# EAGLE design herald_rev_c (EAGLE 8.6.0)

## Sheet 1 of 2
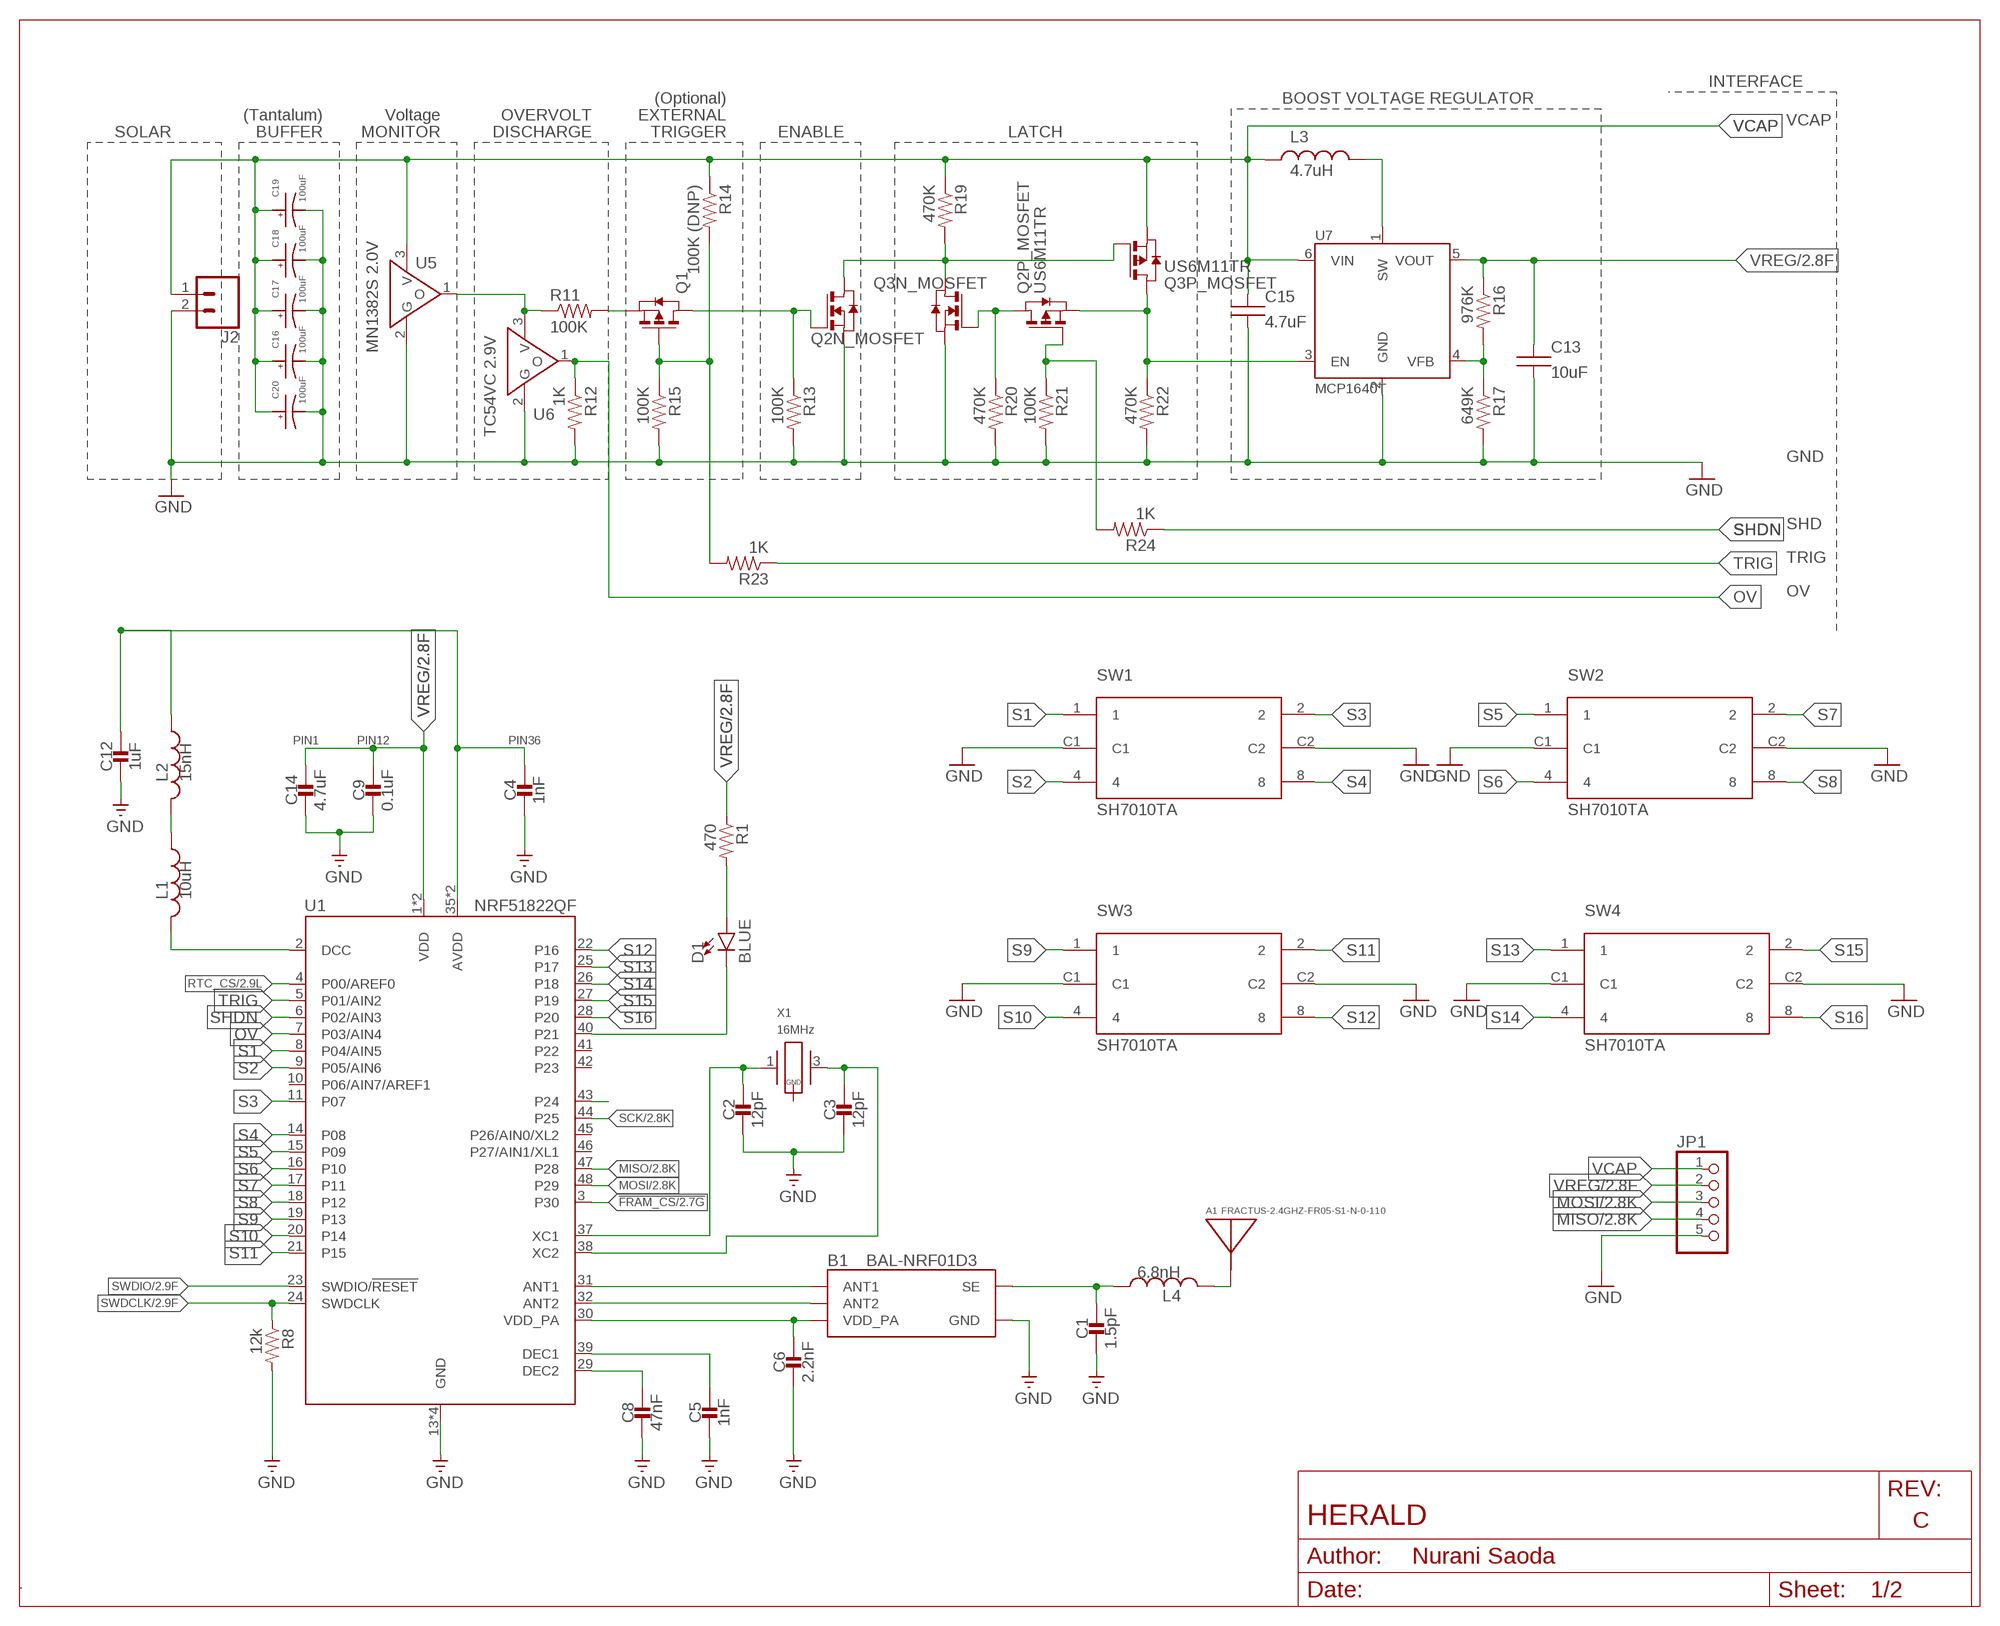
[diagram p0: schematic, sheet 1]
FRAME1 (LETTER_L_BLANK): AUTHOR: Nurani Saoda; REV: C; TITLE: HERALD

### Parts
A1  FRACTUS-2.4GHZ-FR05-S1-N-0-110  [FRACTUS-ANTENNA-FR05-S1-N-0-110]
B1  BAL-NRF01D3  [BAL-NRF01D3]
C1  1.5pF  CAPACITOR0402_CAP  [0402_CAP]
C2  12pF  CAPACITOR0402_CAP  [0402_CAP]
C3  12pF  CAPACITOR0402_CAP  [0402_CAP]
C4  1nF  CAPACITOR0402_CAP  [0402_CAP]
C5  1nF  CAPACITOR0402_CAP  [0402_CAP]
C6  2.2nF  CAPACITOR0402_CAP  [0402_CAP]
C8  47nF  CAPACITOR0402_CAP  [0402_CAP]
C9  0.1uF  CAPACITOR0402_CAP  [0402_CAP]
C12  1uF  CAPACITOR0402_CAP  [0402_CAP]
C13  10uF  CAP  [R0603B]
C14  4.7uF  CAPACITOR0402_CAP  [0402_CAP]
C15  4.7uF  CAP  [R0603B]
C16  100uF  1210_CAP_POLARIZED  [CAP1210]
C17  100uF  1210_CAP_POLARIZED  [CAP1210]
C18  100uF  1210_CAP_POLARIZED  [CAP1210]
C19  100uF  1210_CAP_POLARIZED  [CAP1210]
C20  100uF  1210_CAP_POLARIZED  [CAP1210]
D1  BLUE  LED-BLUE0603  [LED-0603]
J2  CONN_02  [1X02]
JP1  PINHD-1X5  [1X05]
L1  10uH  INDUCTOR0603  [0603_CAP]
L2  15nH  INDUCTOR0402  [0402_CAP]
L3  4.7uH  L-US  [L2828]
L4  6.8nH  INDUCTOR0402  [0402_CAP]
Q1  PMOSSOT23  [SOT-23]
Q2  US6M11TR  [TUMT6]
Q3  US6M11TR  [TUMT6]
R1  470  RESISTOR0402_RES  [0402_RES]
R8  12k  RESISTOR0402_RES  [0402_RES]
R11  100K  RESISTOR  [R0603B]
R12  1K  RESISTOR  [R0603B]
R13  100K  RESISTOR  [R0603B]
R14  100K (DNP)  RESISTOR  [R0603B]
R15  100K  RESISTOR  [R0603B]
R16  976K  RESISTOR  [R0603B]
R17  649K  RESISTOR  [R0603B]
R19  470K  RESISTOR  [R0603B]
R20  470K  RESISTOR  [R0603B]
R21  100K  RESISTOR  [R0603B]
R22  470K  RESISTOR  [R0603B]
R23  1K  RESISTOR  [R0603B]
R24  1K  RESISTOR  [R0603B]
SW1  SH7010TA  [SWTICH-6]
SW2  SH7010TA  [SWTICH-6]
SW3  SH7010TA  [SWTICH-6]
SW4  SH7010TA  [SWTICH-6]
U1  NRF51822QF  [QFN-48-6MM]
U5  MN1382S 2.0V  MN1382S  [MINI-3DC]
U6  TC54VC 2.9V  MN1382S  [MINI-3DC]
U7  MCP1640T  MCP1640  [SOT-23-6]
X1  16MHz  TXC-8Y  [TXC-8Y]

### Nets
!FRAM2_CS: U1.43(P24)
!FRAM_CS: U1.3(P30) ; also sheet 2
GND: B1.GND C1.2 C2.2 C3.2 C4.2 C5.2 C6.2 C8.2 C9.2 C12.2 C13.2 C14.2 C15.2 C16.ANODE C17.ANODE C18.ANODE C19.ANODE C20.ANODE J2.2 JP1.5 Q2.1(N_MOSFET:S) Q3.1(N_MOSFET:S) R8.2 R12.2 R13.2 R15.2 R17.2 R20.2 R21.2 R22.2 SW1.C1 SW1.C2 SW2.C1 SW2.C2 SW3.C1 SW3.C2 SW4.C1 SW4.C2 U1.13(GND) U1.33(GND) U1.34(GND) U1.GND U5.2(G) U6.2(G) U7.2(GND) ; also sheet 2
MISO: JP1.4 U1.47(P28) ; also sheet 2
MOSI: JP1.3 U1.48(P29) ; also sheet 2
N$1: A1.ANT(ANTENNA) L4.2
N$4: Q2.6(N_MOSFET:D) Q3.5(P_MOSFET:G) Q3.6(N_MOSFET:D) R19.2
N$5: B1.ANT1 U1.31(ANT1)
N$6: B1.ANT2 U1.32(ANT2)
N$7: D1.C U1.40(P21)
N$8: D1.A R1.2
N$10: Q2.4(P_MOSFET:S) Q3.3(P_MOSFET:D) R22.1 U7.3(EN)
N$11: B1.SE C1.1 L4.1
N$12: C4.1 C12.1 L2.1 U1.35(AVDD) U1.36(AVDD)
N$13: L1.2 U1.2(DCC)
N$14: L1.1 L2.2
N$16: C2.1 U1.37(XC1) X1.1
N$17: C3.1 U1.38(XC2) X1.3
N$18: C5.1 U1.39(DEC1)
N$19: C8.1 U1.29(DEC2)
N$20: R16.2 R17.1 U7.4(VFB)
N$21: L3.2 U7.1(SW)
N$24: Q2.3(P_MOSFET:D) Q3.2(N_MOSFET:G) R20.1
N$25: Q2.5(P_MOSFET:G) R21.1 R24.2
N$26: Q1.1(D) Q2.2(N_MOSFET:G) R13.1
N$28: R11.1 U5.1(O) U6.3(V)
N$29: Q1.3(G) R14.2 R15.1 R23.2
N$30: Q1.2(S) R11.2
OV: R12.1 U1.7(P03/AIN4) U6.1(O)
RTC_CS: U1.4(P00/AREF0) ; also sheet 2
S1: SW1.1 U1.8(P04/AIN5)
S2: SW1.4 U1.9(P05/AIN6)
S3: SW1.2 U1.11(P07)
S4: SW1.8 U1.14(P08)
S5: SW2.1 U1.15(P09)
S6: SW2.4 U1.16(P10)
S7: SW2.2 U1.17(P11)
S8: SW2.8 U1.18(P12)
S9: SW3.1 U1.19(P13)
S10: SW3.4 U1.20(P14)
S11: SW3.2 U1.21(P15)
S12: SW3.8 U1.22(P16)
S13: SW4.1 U1.25(P17)
S14: SW4.4 U1.26(P18)
S15: SW4.2 U1.27(P19)
S16: SW4.8 U1.28(P20)
SCK: U1.44(P25) ; also sheet 2
SHDN: R24.1 U1.6(P02/AIN3)
SWDCLK: R8.1 U1.24(SWDCLK) ; also sheet 2
SWDIO: U1.23(SWDIO/!RESET) ; also sheet 2
TRIG: R23.1 U1.5(P01/AIN2)
VCAP: C15.1 C16.CATHODE C17.CATHODE C18.CATHODE C19.CATHODE C20.CATHODE J2.1 JP1.1 L3.1 Q3.4(P_MOSFET:S) R14.1 R19.1 U5.3(V) U7.6(VIN)
VDD_PA: B1.VCC(VDD_PA) C6.1 U1.30(VDD_PA)
VREG: C9.1 C13.1 C14.1 JP1.2 R1.1 R16.1 U1.1(VDD) U1.12(VDD) U7.5(VOUT) ; also sheet 2
Unconnected: U1.10(P06/AIN7/AREF1) U1.41(P22) U1.42(P23) U1.45(P26/AIN0/XL2) U1.46(P27/AIN1/XL1) X1.2(GND) X1.4(GND)

### Notes on the sheet
- INTERFACE
- (Optional) | BOOST VOLTAGE REGULATOR
- (Tantalum) | Voltage | OVERVOLT | EXTERNAL
- SOLAR | BUFFER | MONITOR | DISCHARGE | TRIGGER | ENABLE | LATCH | VCAP
- GND
- SHD
- TRIG
- OV
- PIN1 | PIN12 | PIN36

## Sheet 2 of 2
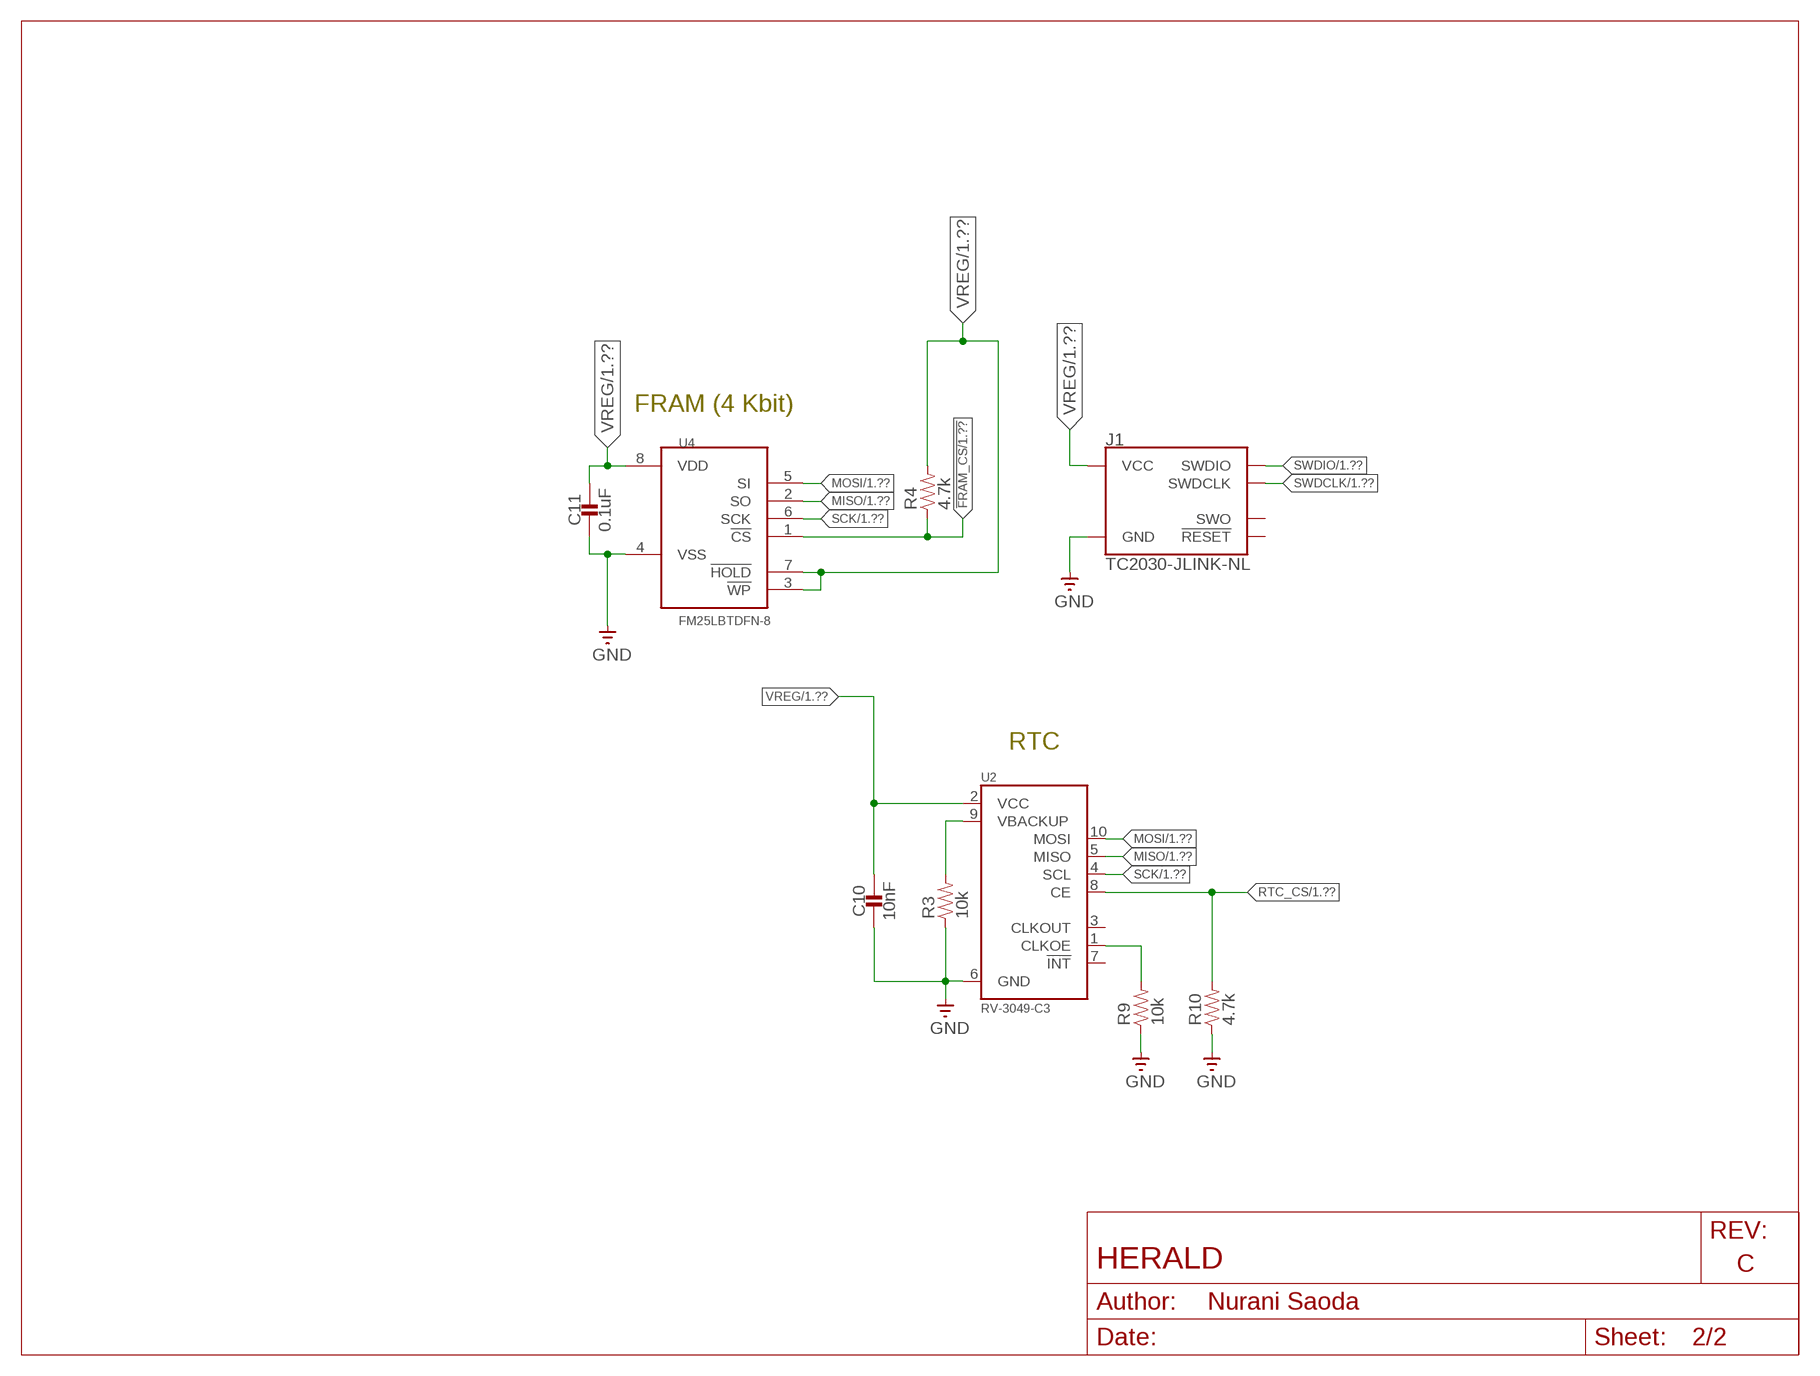
[diagram p1: schematic, sheet 2]
FRAME2 (LETTER_L_BLANK): AUTHOR: Nurani Saoda; REV: C; TITLE: HERALD

### Parts
C10  10nF  CAPACITOR0402_CAP  [0402_CAP]
C11  0.1uF  CAPACITOR0402_CAP  [0402_CAP]
J1  TC2030-JLINK-NL  [TC2030-IDC-NL]
R3  10k  RESISTOR0402_RES  [0402_RES]
R4  4.7k  RESISTOR0402_RES  [0402_RES]
R9  10k  RESISTOR0402_RES  [0402_RES]
R10  4.7k  RESISTOR0402_RES  [0402_RES]
U2  RV-3049-C3  [MICRO-CRYSTAL-C3]
U4  FM25LBTDFN-8  [TDFN-8@1]

### Nets
!FRAM_CS: R4.1 U4.1(!CS) ; also sheet 1
GND: C10.2 C11.2 J1.5(GND) R3.1 R9.1 R10.1 U2.6(GND) U4.4(VSS) ; also sheet 1
MISO: U2.5(MISO) U4.2(SO) ; also sheet 1
MOSI: U2.10(MOSI) U4.5(SI) ; also sheet 1
N$2: R3.2 U2.9(VBACKUP)
N$3: R9.2 U2.1(CLKOE)
RTC_CS: R10.2 U2.8(CE) ; also sheet 1
SCK: U2.4(SCL) U4.6(SCK) ; also sheet 1
SWDCLK: J1.4(SWDCLK) ; also sheet 1
SWDIO: J1.2(SWDIO) ; also sheet 1
VREG: C10.1 C11.1 J1.1(VCC) R4.2 U2.2(VCC) U4.3(!WP) U4.7(!HOLD) U4.8(VDD) ; also sheet 1
Unconnected: J1.3(!RESET) J1.6(SWO) U2.3(CLKOUT) U2.7(!INT)

### Notes on the sheet
- FRAM (4 Kbit)
- RTC

## Library data of the parts
A1 = chips:FRACTUS-2.4GHZ-FR05-S1-N-0-110: Fractus Micro Reach Xtend Requires matching network.; RICHARDSON_RFPD: FR05-S1-N-0110B
B1 = chips:BAL-NRF01D3: 50 ohm nominal input / conjugate match balun to nRF51422-QFAA, nRF24LE1, nRF51822-QFAA/AB, with integrated harmonic filter; DIGIKEY: 497-13637-1-ND; MANUFACTURER: STMicroelectronics; MOUSER: 511-BAL-NRF01D3; MPN: BAL-NRF01D3
C1-C6 C8-C12 C14 = passives:CAPACITOR: SMD Capacitor
C13 C15 = Gecko:CAP
C16-C20 = Gecko:1210_CAP_POLARIZED
D1 = SparkFun-LED:LED-BLUE: Blue SMD LED Used in manufacturing of various products at SparkFun Packages: 0603 - SMD 0603 package [Product Link] <http://www.digikey.com/product-detail/en/SMLE12BC7TT86/511-1589-2-ND/1641808> 1206 - SMD1206 package [Product Link] <http://www.digikey.com/product-detail/en/lite-on-inc/LTST-C150TBKT/160-1643-1-ND/573584> SparkFun Products: ESP8266 Thing-Dev Board <https://www.sparkfun.com/products/13711> RedBoard <https://www.sparkfun.com/products/12757>; PROD_ID: DIO-08575
J1 = connector:TC2030-JLINK
J2 = SparkFun-Retired:CONN_02: Multi connection point. Often used as Generic Header-pin footprint for 0.1 inch spaced/style header connections On any of the 0.1 inch spaced packages, you can populate with these: Break Away Headers - Straight <https://www.sparkfun.com/products/116> (PRT-00116) Break Away Male Headers - Right Angle <https://www.sparkfun.com/products/553> (PRT-00553) Female Headers <https://www.sparkfun.com/products/115> (PRT-00115) Break Away Headers - Machine Pin <https://www.sparkfun.com/products/117> (PRT-00117) Break Away Female Headers - Swiss Machine Pin <https://www.sparkfun.com/products/743> (PRT-00743) For SCREWTERMINALS and SPRING TERMINALS visit here: Screw Terimnals on SparkFun.com <https://www.sparkfun.com/search/results?term=Screw+Terminals> (5mm/3.5mm/2.54mm spacing) This device is also useful as a general connection point to wire up your design to another part of your project. Our various solder wires solder well into these plated through hole pads. Hook-Up Wire - Assortment (Stranded, 22 AWG) <https://www.sparkfun.com/products/11375> (PRT-11375) Hook-Up Wire - Assortment (Solid Core, 22 AWG) <https://www.sparkfun.com/products/11367> (PRT-11367) View the entire wire category on our website here <https://www.sparkfun.com/categories/141> Special notes: Molex polarized connector foot print use with: PRT-08233 with associated crimp pins and housings. 2.54_SCREWTERM for use with PRT-10571. 3.5mm Screw Terminal footprints for PRT-08084 5mm Screw Terminal footprints for use with PRT-08432
JP1 = pinhead:PINHD-1X5: PIN HEADER
L1 = passives:INDUCTOR: A very specific inductor; DIGIKEY: 490-4025-1-ND
L2 L4 = passives:INDUCTOR: A very specific inductor; DIGIKEY: 587-1521-1-ND
L3 = Gecko:L-US
Q1 = berkeley-epic:PMOSSOT23: MOS FET
Q2 Q3 = DUALMOS:US6M11TR; DIGIKEY: US6M11CT-ND
R1 = passives:RESISTOR: Resistor Basic schematic elements and footprints for 0603, 1206, and PTH resistors.; DIGIKEY: RHM470CECT-ND
R3 R9 = passives:RESISTOR: Resistor Basic schematic elements and footprints for 0603, 1206, and PTH resistors.; DIGIKEY: RHM10KCECT-ND
R4 R10 = passives:RESISTOR: Resistor Basic schematic elements and footprints for 0603, 1206, and PTH resistors.; DIGIKEY: RHM4.7KCECT-ND
R8 = passives:RESISTOR: Resistor Basic schematic elements and footprints for 0603, 1206, and PTH resistors.; DIGIKEY: RHM12.0KCDCT-ND
R11-R17 R19-R24 = Gecko:RESISTOR
SW1-SW4 = sh7010TA:SH7010TA; DIGIKEY: 563-1207-2-ND
U1 = chips:NRF51822: Multiprotocol Bluetooth® 4.0 low energy/2.4 GHz RF SoC; DIGIKEY: 1490-1042-1-ND; MANUFACTURER: Nordic Semi; MOUSER: 949-NRF51822-QFAC-R7; MPN: NRF51822-QFAC-R7
U2 = chips:RV-3049-C3: The RV-3049-C3 is an ultra miniature Real-Time-Clock Module with embedded Crystal. This RTC has an SPI Bus (4-wire Serial- Interface) and offers temperature compensated time.; NEWARK: RV-3049-C3
U4 = chips:FM25LB: IC FRAM 4KBIT 10MHZ 8SOIC; DIGIKEY: FM25L04B-DGRA-ND; MOUSER: 877-FM25L04B-DG
U5 U6 = umich:MN1382S
U7 = Gecko:MCP1640
X1 = crystals:TXC-8Y: 2mmx1.6mm SMD Crystal; DIGIKEY: 887-2003-1-ND

## Board
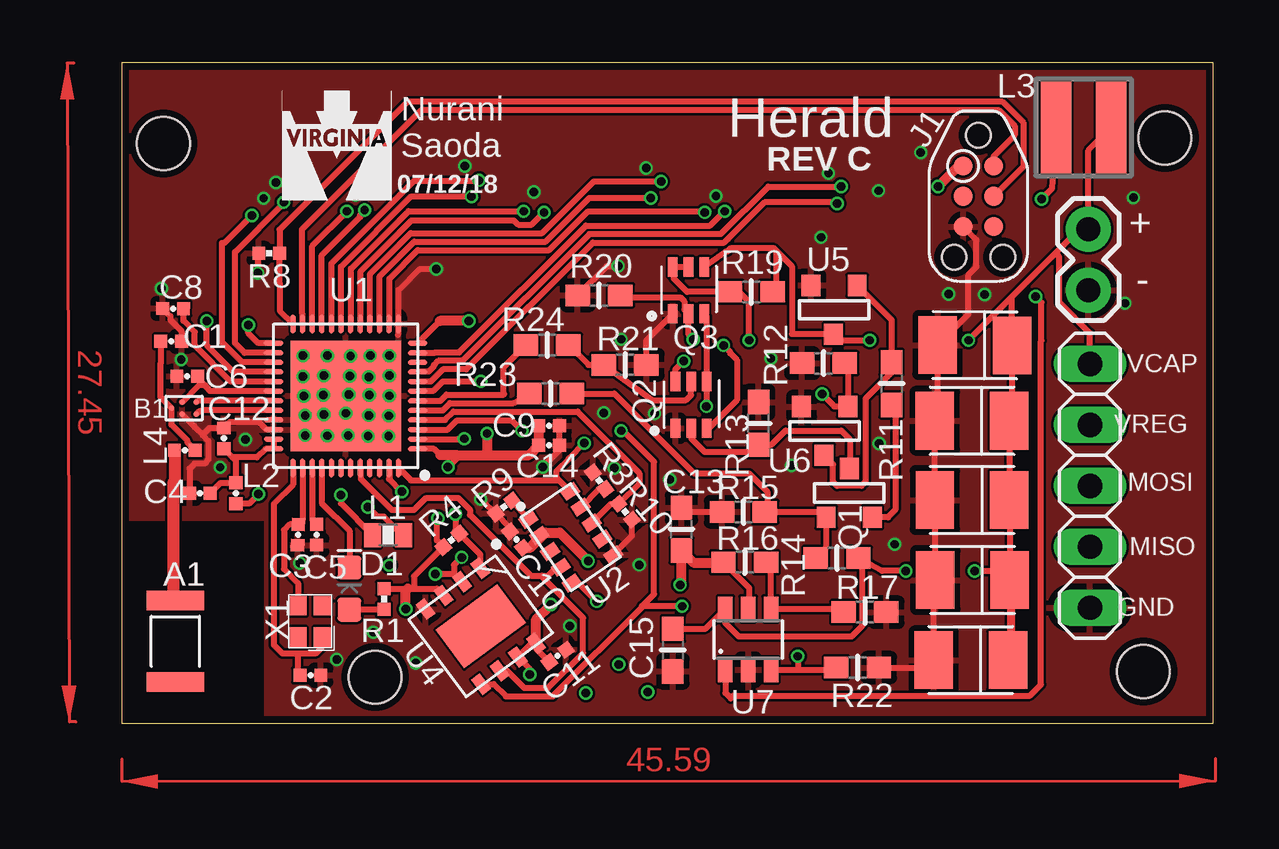
[diagram p2: board, top side]
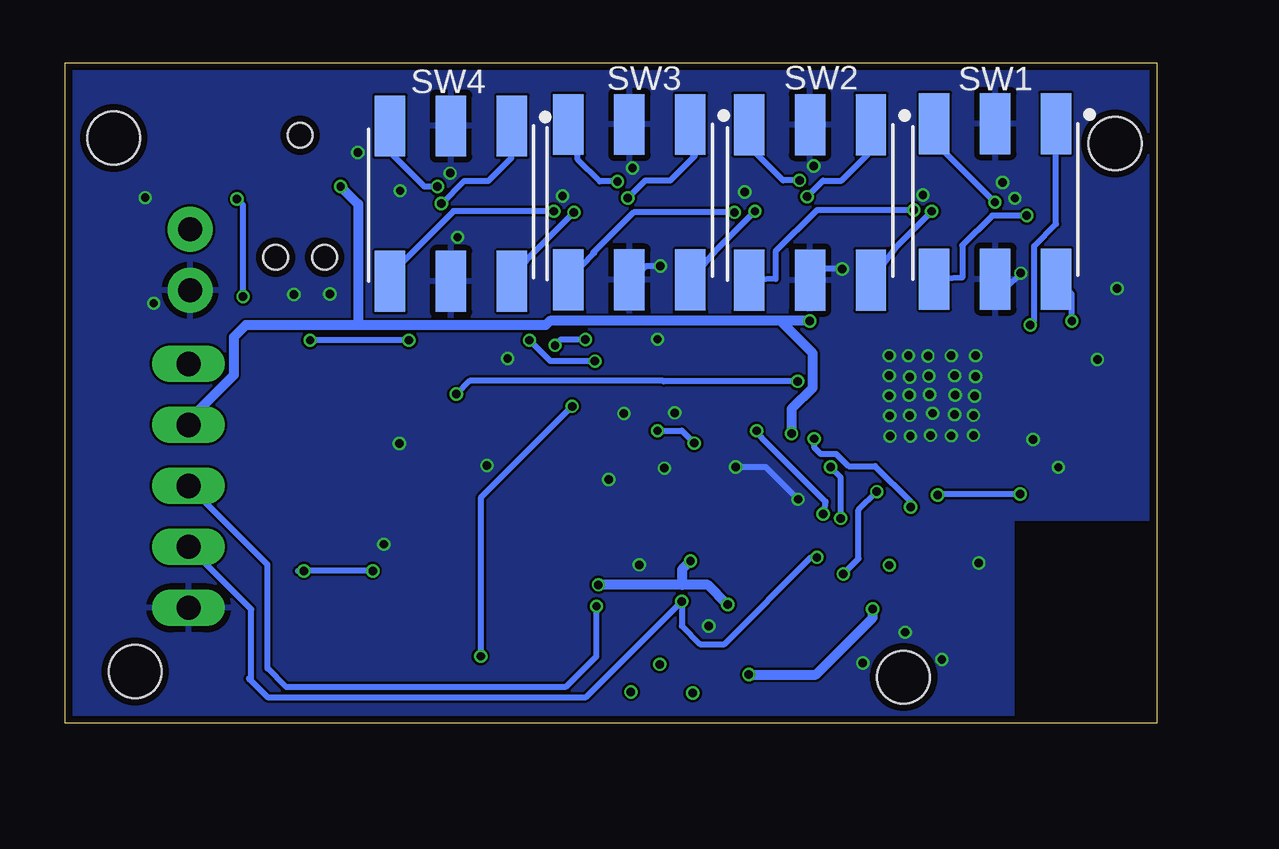
[diagram p3: board, bottom side, seen from below]

Size 45.5 x 27.53 mm. Coordinates in mm from the lower left corner, seen from the top.
Outline: 0,27.53 0,0 45.5,0 45.5,27.53 0,27.53
Copper layers (1*16): Top 0.0178mm / dielectric 59mil / Bottom 0.0178mm
Design rules "quickturn_co_kr_1oz *": minimum track width 4mil, minimum drill 0.200659375mm, track to track 4mil, track to pad 6mil, pad to pad 6mil, via to via 6mil, smd to smd 6mil, copper to edge 12mil, drill to drill 12mil, minimum pad ring 8mil, minimum via ring 4mil, stop-mask expansion 3mil, vias tented up to drill 50mil, thermal gap 10mil
Holes 2.2 mm at 10.56,1.92 43.48,24.39 42.58,2.16 1.73,24.16

### Footprints (pad centres in the part's own frame; a part is rotated, then mirrored left to right if it is on the bottom)
FRACTUS-ANTENNA-FR05-S1-N-0-110 = smd 0.8 x 2.4: ANT -1.7,0; NULL 1.7,0
BAL-NRF01D3 = smd 0.22 x 0.22: ANT1 -0.517,-0.25; ANT2 -0.517,0.25; GND 0.083,0.25; SE 0.516,0; VCC 0.083,-0.25
0402_CAP = smd 0.536 x 0.546: 1 -0.433,0; 2 0.433,0
R0603B = smd 1.016 x 0.889: 1 -0.889,0; 2 0.889,0
CAP1210 = smd 2.4 x 1.6: ANODE 0,-1.55; CATHODE 0,1.55
LED-0603 = smd 1 x 1: A -0.877,0; C 0.877,0
TC2030-IDC-NL = smd 0.787 x 0.787: 1 -1.27,-0.635; 2 -1.27,0.635; 3 0,-0.635; 4 0,0.635; 5 1.27,-0.635; 6 1.27,0.635 | hole 1.016: -2.54,0; 2.54,1.016; 2.54,-1.016
1X02 = drill 1.016 pad 1.88: 1 0,0; 2 2.54,0
1X05 = drill 1.016 long: 1 -5.08,0; 2 -2.54,0; 3 0,0; 4 2.54,0; 5 5.08,0
0603_CAP = smd 0.7 x 1: 1 -0.65,0; 2 0.65,0
L2828 = smd 1.27 x 3.81: 1 -1.143,0; 2 1.143,0
SOT-23 = smd 0.787 x 0.889: 1 0.025,-1.016; 2 -0.94,1.016; 3 0.991,1.016
TUMT6 = smd 0.4 x 0.8: 1 -0.65,-0.65; 2 0,-0.65; 3 0.65,-0.65; 4 0.65,1.3; 5 0,1.3; 6 -0.65,1.3
0402_RES = smd 0.536 x 0.546: 1 -0.433,0; 2 0.433,0
SWTICH-6 = smd 2.54 x 1.27: 1 0,2.54; 2 6.477,-2.54; 4 0,-2.54; 8 6.477,2.54; C1 0,0; C2 6.477,0
QFN-48-6MM = smd 0.8 x 0.203: 1 -3,2.2; 2 -3,1.8; 3 -3,1.4; 4 -3,1; 5 -3,0.6; 6 -3,0.2; 7 -3,-0.2; 8 -3,-0.6; 9 -3,-1; 10 -3,-1.4; 11 -3,-1.8; 12 -3,-2.2; 25 3,-2.2; 26 3,-1.8; 27 3,-1.4; 28 3,-1; 29 3,-0.6; 30 3,-0.2; 31 3,0.2; 32 3,0.6; 33 3,1; 34 3,1.4; 35 3,1.8; 36 3,2.2 | smd 0.203 x 0.8: 13 -2.2,-3; 14 -1.8,-3; 15 -1.4,-3; 16 -1,-3; 17 -0.6,-3; 18 -0.2,-3; 19 0.2,-3; 20 0.6,-3; 21 1,-3; 22 1.4,-3; 23 1.8,-3; 24 2.2,-3; 37 2.2,3; 38 1.8,3; 39 1.4,3; 40 1,3; 41 0.6,3; 42 0.2,3; 43 -0.2,3; 44 -0.6,3; 45 -1,3; 46 -1.4,3; 47 -1.8,3; 48 -2.2,3 | smd 4.6 x 4.6: GND 0,0
MICRO-CRYSTAL-C3 = smd 0.5 x 0.7: 1 -1.6,-1.05; 2 -0.8,-1.05; 3 0,-1.05; 4 0.8,-1.05; 5 1.6,-1.05; 6 1.6,1.05; 7 0.8,1.05; 8 0,1.05; 9 -0.8,1.05; 10 -1.6,1.05
TDFN-8@1 = smd 0.45 x 0.8: 1 -1.425,-1.95; 2 -0.475,-1.95; 3 0.475,-1.95; 4 1.425,-1.95; 5 1.425,1.95; 6 0.475,1.95; 7 -0.475,1.95; 8 -1.425,1.95 | smd 3.2 x 2: NC 0,0
MINI-3DC = smd 0.787 x 0.889: 1 -0.991,-1.016; 2 0.94,-1.016; 3 0,1.016
SOT-23-6 = smd 0.61 x 1.016: 1 -0.953,-1.27; 2 0,-1.27; 3 0.953,-1.27; 4 0.953,1.27; 5 0,1.27; 6 -0.953,1.27
TXC-8Y = smd 0.8 x 0.7: 1 -0.65,-0.5; 2 0.65,-0.5; 3 0.65,0.5; 4 -0.65,0.5

### Placement (x,y rotation side)
A1  2.23,3.42 270 top
B1  2.59,13.13 180 top
C1  2.06,15.91 0 top
C2  7.86,2 0 top
C3  7.35,7.85 267.7 top
C4  3.26,9.59 180 top
C5  8.12,7.86 270 top
C6  2.73,14.45 180 top
C8  2.14,17.28 179.4 top
C9  17.81,12.4 0 top
C10  16.45,7.66 128.7 top
C11  18.17,2.81 36.6 top
C12  4.25,11.87 90 top
C13  23.33,8.09 90 top
C14  17.81,11.58 0 top
C15  22.97,3.05 270 top
C16  35.56,15.75 269.8 top
C17  35.44,12.61 270 top
C18  35.44,9.3 270 top
C19  35.46,5.97 270 top
C20  35.39,2.63 270 top
D1  9.49,5.61 90 top
J1  35.71,21.96 270 top
J2  40.29,20.58 270 top
JP1  40.35,9.89 270 top
L1  11.1,7.85 0 top
L2  4.76,9.59 270 top
L3  40.09,24.82 180 top
L4  2.63,11.38 180 top
Q1  30.35,9.6 180 top
Q2  23.73,12.94 0 top
Q3  23.62,17.71 0 top
R1  10.93,5.18 270 top
R3  19.89,10.11 306.8 top
R4  13.74,7.63 220.2 top
R8  6.14,19.58 180 top
R9  15.93,9.01 38.3 top
R10  20.99,8.81 130.2 top
R11  32.08,14.16 270 top
R12  29.25,15.01 180 top
R13  26.54,12.5 90 top
R14  29.81,6.89 180 top
R15  25.91,8.81 180 top
R16  25.97,6.71 0 top
R17  30.98,4.63 0 top
R19  26.24,17.98 180 top
R20  19.89,17.83 180 top
R21  20.98,14.93 0 top
R22  30.67,2.32 0 top
R23  17.87,13.74 0 top
R24  17.73,15.76 0 top
SW1  29.42,24.89 270 bottom
SW2  21.98,24.95 270 bottom
SW3  14.45,24.94 270 bottom
SW4  6.74,24.99 270 bottom
U1  9.34,13.64 180 top
U2  18.72,7.75 304.3 top
U4  14.96,4.04 216.6 top
U5  29.66,17.23 180 top
U6  29.27,12.18 180 top
U7  26.11,3.5 0 top
X1  7.85,4.25 90 top

### Tracks (layer width: path | path; a pad name or v marks a point on that pad's centre or on a via)
!FRAM_CS  (via drill 0.35)
  Top 0.254: U1.3 13.59,12.24 13.98,12.63 16.24,12.63 v16.68,12.19 | U4.1 14.94,7.04 R4.1 13.99,7.91 13.88,8.02 13.9,8.05 v13.9,8.73
  Bottom 0.254: v16.68,12.19 16.43,11.85 13.81,9.23 v13.9,8.73
GND  (via drill 0.35)
  Top 0.254: C20.ANODE 33.84,2.79 | 33.84,2.79 33.84,3.05 | 33.84,3.05 33.84,5.9 C19.ANODE 33.91,9.29 C18.ANODE C17.ANODE 34.01,12.73 C16.ANODE 35.3,17.05 35.3,18.7 35.63,19.03 35.63,20.13 J1.5 | 33.8,3.08 33.84,3.05 | R22.2 33.37,2.32 33.84,2.79 | 31.56,4.58 R17.2 | R21.2 21.86,15.96 Q3.1 | C10.2 16.18,8.16 R9.1 15.46,8.88 v14.95,9.34 | B1.GND 3,12.39 3.03,12.39 3.03,12.34 3.36,12.01 | 7.77,13.64 U1.GND 9.34,14 | 11.52,16.18 11.52,16.62 U1.13 11.54,18.05 12.42,18.93 v13.12,18.93 | v17.55,10.68 18.24,11.37 C14.2 C9.2 | U2.6 21.27,7.81 R10.1 | C13.2 23.5,8.81 R15.2 | C1.2 2.49,16.34 2.02,16.82 2.02,16.97 C8.2 | 3.36,12.01 3.61,11.77 3.61,10.99 3.45,10.82 3.03,10.82 2.82,10.61 C4.2 | U1.34 6.04,12.24 5.73,12.55 4.5,12.55 C12.2 3.65,12.3 3.36,12.01 | R20.2 20.23,19.05 v20.69,19.05 | R8.2 5.67,19.53 v5.67,18.76
  Bottom 0.254: v14.95,9.34 16.29,10.68 v17.55,10.68 | v13.12,18.93 13.99,18.93 SW3.C2 | v20.69,19.05 21.28,19.05 SW2.C2 | v5.67,18.76 6.28,18.14 6.65,18.51 SW4.C2
  other vias: 20.81,16 22.21,12.9 20.52,10.63 18.67,4.06 22.84,10.16 21.57,6.6 7.42,6.68 27.06,15.2 5.91,21.88 29.14,20.25 7.55,15.32 8.56,15.32 9.54,15.3 10.35,15.32 11.15,15.32 11.15,14.48 10.3,14.43 9.5,14.47 8.42,14.48 7.55,14.45 7.59,13.63 8.41,13.68 9.47,13.7 10.32,13.68 11.15,13.65 7.64,12.83 8.42,12.87 9.35,12.92 10.3,12.83 11.14,12.82 11.12,11.96 10.27,11.96 9.43,12 8.56,11.98 7.64,12 4.1,10.67 5.16,11.83 14.3,23.22 21.85,23.14 29.45,22.92 1.65,18.11 2.47,15.16 9.75,22.02 17.17,22.14 24.77,21.97 31.54,22.19 31.57,11.66 32.22,7.46 20.09,12.94 27.92,10.74 34.46,17.89 35.96,17.86 10.49,3.79 8.96,2.66 12.25,2.51 33.3,23.78 42.17,21.9 41.81,17.5 6.42,22.53
  pour Top: 0,28.51 47,28.51 47,-0.49 6,-0.49 6,8.51 0,8.51
  pour Bottom: -1,29.51 48,29.51 48,-1.49 6,-1.49 6,8.51 -1,8.51
MISO  (via drill 0.35)
  Top 0.254: 11.15,10.18 11.15,10.62 U1.47 11.13,10.18 v11.67,9.65 | v13.06,6.22 13.85,6.22 | 13.85,6.22 U4.2 | U2.5 19.04,5.84 v19.8,5.08 | v14.16,6.92 13.85,6.6 13.85,6.22
  Bottom 0.254: v13.06,6.22 12.43,6.86 12.43,8.89 v11.67,9.65 | v14.16,6.92 14.4,6.92 18.02,3.3 19.03,3.3 19.8,4.06 v19.8,5.08 23.79,1.09 37.07,1.09 37.74,1.76 | 37.84,1.86 37.74,1.76 | 37.74,1.76 37.74,4.74 JP1.4
MOSI  (via drill 0.35)
  Top 0.254: 18.23,10.12 18.1,10.25 18.1,10.5 18.66,11.05 | 18.23,10.12 U2.10 | U4.5 15.5,1.63 16.01,1.12 17.96,1.12 21.68,4.84 21.68,4.88 | 21.68,4.88 22.19,5.39 22.19,10.89 20.89,12.19 v20.81,12.19 | v19.28,11.67 18.66,11.05 | 18.66,11.05 18.65,11.05 18.6,11.01 | U1.48 12.05,10.12 18.23,10.12 | v23.35,4.88 21.68,4.88
  Bottom 0.254: v20.81,12.19 19.8,12.19 v19.28,11.67 | v23.35,4.88 23.35,2.79 24.62,1.52 36.31,1.52 37.07,2.29 37.07,6.61 JP1.3
N$1
  Top 0.508: L4.2 2.2,10.08 2.15,10.03 2.15,5.2 A1.ANT
N$2
  Top 0.254: U2.9 19.89,9.77 R3.2
N$3
  Top 0.254: R9.2 16.95,8.52 U2.1
N$4  (via drill 0.35)
  Top 0.254: Q3.6 23.01,19.01 | 23.01,19.01 Q3.5 | Q2.6 23.08,14.75 v23.42,15.09 | v26.15,15.96 26.15,17.56 25.73,17.98 R19.2 | 23.01,19.01 23.01,18.53 23.56,17.98 R19.2 | R19.2 25.64,18.01 25.64,18.07
  Bottom 0.254: v23.42,15.09 25.27,15.09 v26.15,15.96
N$5
  Top 0.254: U1.31 3.16,13.44 B1.ANT1
N$6
  Top 0.254: U1.32 3.31,13.04 3.27,12.99 3.22,12.99 B1.ANT2
N$7
  Top 0.254: U1.40 8.34,9.18 9.48,8.03 D1.C
N$8
  Top 0.254: D1.A R1.2
N$10  (via drill 0.35)
  Top 0.254: U7.3 28.18,2.23 | 28.18,2.23 29.68,2.23 R22.1 | v24.37,13.21 24.38,13.47 24.38,14.22 Q2.4 24.38,16.96 Q3.3 | v28.18,2.79 28.18,2.23
  Bottom 0.254: v24.37,13.21 28.18,9.4 v28.18,2.79
N$11
  Top 0.254: C1.1 1.63,15.02 1.6,14.99 1.6,13.61 B1.SE 2.07,12.43 2.74,11.77 2.74,11.7 L4.1
N$12
  Top 0.254: U1.35 U1.36 5.99,11.44 5.63,11.08 4.62,11.08 | C4.1 4.12,10.02 L2.1 | L2.1 4.81,10.07 | 4.62,11.08 C12.1 | L2.1 4.76,10.93 4.62,11.08
N$13  (via drill 0.35)
  Top 0.254: v10.25,9.01 10.64,8.62 10.91,8.62 11.69,7.84 L1.2 | U1.2 14.01,11.84 v14.28,11.86
  Bottom 0.254: v10.25,9.01 10.25,9.23 11.74,10.71 12.85,10.71 13.37,11.23 14.01,11.23 14.28,11.51 v14.28,11.86
N$14  (via drill 0.35)
  Top 0.254: v5.69,9.54 v5.7,9.55 5.3,9.15 L2.2 | v9.13,9.52 9.13,9.16 L1.1
  Bottom 0.254: v5.7,9.55 9.1,9.55 v9.13,9.52
N$15  (via drill 0.35)
  other vias: 11.15,6.59
N$16
  Top 0.254: U1.37 7.13,9.95 6.33,9.14 6.33,3.27 6.68,2.92 7.35,2.92 | 7.35,2.92 8.06,2.92 8.08,2.9 8.35,3.17 X1.1 | C2.1 7.35,2.08 7.35,2.92
N$17
  Top 0.254: U1.38 7.54,8.46 C3.1 7,8.29 6.76,8.05 6.76,6.43 7.35,5.85 X1.3
N$18
  Top 0.254: U1.39 7.93,8.48 C5.1
N$19
  Top 0.254: U1.29 4.55,14.24 3.04,15.74 3.04,16.3 2.57,16.77 C8.1
N$20
  Top 0.254: R17.1 29.7,4.77 U7.4 27.06,6.51 R16.2
N$21  (via drill 0.35)
  Top 0.254: U7.1 25.16,1.26 25.38,1.04 25.5,1.15 37.86,1.15 38.31,1.61 38.31,15.93 38.34,15.95 38.34,17.53 v38.08,17.78 | v38.34,21.84 38.78,22.29 L3.2
  Bottom 0.254: v38.08,17.78 38.08,21.59 v38.34,21.84
N$22  (via drill 0.35)
  other vias: 19.34,1.26
N$23  (via drill 0.35)
  other vias: 20.72,2.46
N$24  (via drill 0.35)
  Top 0.254: Q2.3 24.47,12.29 25.64,13.46 25.64,15.14 25.37,15.41 25.37,15.46 v25.08,15.75 | v23.81,16 23.62,16.19 Q3.2 23.45,17.23 23.45,17.58 23.29,17.74 20.87,17.74 R20.1 20.61,17.74
  Bottom 0.254: v25.08,15.75 24.83,16 v23.81,16
N$25
  Top 0.254: R21.1 22.13,13.46 23.51,13.46 23.73,13.68 Q2.5 | 18.65,15.47 R24.2 19.44,14.93 R21.1 | 20.02,15.25 R21.1
N$26
  Top 0.254: Q2.2 23.73,11.87 24.29,11.31 26.24,11.31 R13.1 27.09,11.61 27.67,12.19 29.99,12.19 30.34,11.84 30.34,10.64 Q1.1
N$27  (via drill 0.35)
  other vias: 21.92,1.31
N$28
  Top 0.254: U5.1 32.08,16.81 R11.1 32.08,14.61 31,13.53 31,10.06 30.83,9.89 29.82,9.89 29.65,10.06 29.65,10.79 U6.3
N$29
  Top 0.254: R15.1 26.91,8.81 | 26.91,8.81 29.14,8.81 Q1.3 29.36,7.32 R14.2 | R23.2 20.53,13.74 23.86,10.41 26.15,10.41 26.91,9.65 26.91,8.81
N$30
  Top 0.254: R11.2 32.24,13.11 32.24,8.89 31.94,8.59 Q1.2
OV  (via drill 0.35)
  Top 0.254: R12.1 30.26,14.88 U6.1 | U6.1 | U1.7 12.35,13.86 13,13.86 13.39,14.25 v14.97,14.25 | v29.19,13.72 29.7,13.21 U6.1
  Bottom 0.254: v14.97,14.25 20.56,14.25 20.58,14.27 28.64,14.27 v29.19,13.72
RTC_CS
  Top 0.254: U1.4 13.48,12.64 13.83,12.98 19.01,12.98 21.57,10.41 21.57,10.01 R10.2 20.38,9.15 U2.8
S1  (via drill 0.35)
  Top 0.254: v29.82,21.66 29.77,21.71 26.79,21.71 25.27,20.18 | 25.27,20.18 25.11,20.02 19.63,20.02 14.36,14.75 13.38,14.75 12.88,14.24 U1.8 | 25.27,20.18
  Bottom 0.254: SW1.1 26.9,23.56 27.86,22.6 28.87,22.6 v29.82,21.66
S2  (via drill 0.35)
  Top 0.254: U1.9 12.35,14.66 12.79,14.66 13.02,14.88 13.02,14.92 13.19,15.1 14.21,15.1 19.49,20.38 24.96,20.38 26.94,22.36 v29.98,22.36
  Bottom 0.254: v29.98,22.36 30.53,22.36 31.98,23.81 SW1.4
S3  (via drill 0.35)
  Top 0.254: v25.13,21.34 v25.12,21.34 24.52,20.73 19.34,20.73 14.06,15.46 13.04,15.46 13.03,15.44 U1.11
  Bottom 0.254: v25.13,21.34 29.32,21.34 31.98,18.67 SW1.2
S4  (via drill 0.35)
  Top 0.254: U1.14 11.15,16.66 11.15,18.53 12.34,19.71 17.82,19.71 19.44,21.33 24.25,21.33 v24.29,21.29
  Bottom 0.254: v24.29,21.29 26.25,19.33 SW1.8
S5  (via drill 0.35)
  Top 0.254: U1.15 10.75,16.66 10.75,18.63 12.19,20.07 17.67,20.07 19.49,21.89 v22.05,21.89
  Bottom 0.254: v22.05,21.89 21.32,22.62 20.27,22.62 19.25,23.64 19.42,23.8 SW2.1
S6  (via drill 0.35)
  Top 0.254: U1.16 10.35,16.66 10.35,18.73 12.04,20.42 17.52,20.42 19.67,22.58 v22.48,22.58
  Bottom 0.254: v22.48,22.58 23.21,22.58 24.13,23.5 24.13,24.49 SW2.4
S7  (via drill 0.35)
  Top 0.254: U1.17 9.95,16.66 9.95,18.84 12.08,20.96 16.34,20.96 16.52,20.78 17.09,20.78 v17.6,21.29
  Bottom 0.254: v17.6,21.29 21.8,21.29 23.48,19.62 23.45,19.59 SW2.2
S8  (via drill 0.35)
  Top 0.254: U1.18 9.55,16.66 9.55,18.94 11.95,21.34 v16.75,21.34
  Bottom 0.254: v16.75,21.34 18.37,19.72 SW2.8
S9  (via drill 0.35)
  Top 0.254: U1.19 9.13,19.02 12.07,21.96 14.56,21.96 v14.58,21.94
  Bottom 0.254: v14.58,21.94 13.91,22.61 13.14,22.61 11.91,23.84 SW3.1
S10  (via drill 0.35)
  Top 0.254: U1.20 8.73,19.16 12.18,22.61 12.18,22.6 14.89,22.6 v14.89,22.62
  Bottom 0.254: v14.89,22.62 15.57,22.62 16.99,24.05 SW3.4
S11  (via drill 0.35)
  Top 0.254: v10.12,21.38 9.94,21.2 9.94,21.11 8.34,19.5 U1.21
  Bottom 0.254: v10.12,21.38 14.16,21.38 15.88,19.66 15.88,18.52 SW3.2
S12  (via drill 0.35)
  Top 0.254: U1.22 7.93,19.89 v9.38,21.34
  Bottom 0.254: v9.38,21.34 10.86,19.86 SW3.8
S13  (via drill 0.35)
  Top 0.254: U1.25 5.69,15.84 5.27,16.26 v5.27,16.6
  Bottom 0.254: v5.27,16.6 5.11,16.76 5.11,19.89 4.2,20.81 SW4.1
S14  (via drill 0.35)
  Top 0.254: U1.26 5.12,15.44 4.71,15.84 4.71,19.63 6.75,21.67 v6.75,21.71
  Bottom 0.254: v6.75,21.71 9.28,24.24 SW4.4
S15  (via drill 0.35)
  Top 0.254: U1.27 5.01,15.04 4.18,15.87 4.18,20 4.27,20 v5.42,21.15
  Bottom 0.254: SW4.2 8.11,18.57 8.11,19.91 6.86,21.15 v5.42,21.15
S16  (via drill 0.35)
  Top 0.254: U1.28 4.65,14.64 3.54,15.75 v3.54,16.76
  Bottom 0.254: v3.54,16.76 3.54,17.89 SW4.8
SCK
  Top 0.254: U1.44 9.95,10.62 9.95,10.18 11.25,8.89 12.18,8.89 12.68,9.4 14.02,9.4 14.52,8.9 14.52,8.69 17.05,6.15 17.51,6.15 | 17.51,6.15 17.77,6.15 18.12,6.5 U2.4 | U4.6 16.05,2.2 16.77,1.48 17.78,1.48 19.23,2.93 19.23,4.39 17.51,6.11 17.51,6.15
SHDN
  Top 0.254: 15.91,13.69 15.94,13.72 | 15.91,13.69 13.53,13.69 13.28,13.44 U1.6 | 15.91,13.69 15.91,14.84 R24.1
SWDCLK
  Top 0.254: U1.24 6.61,17.17 6.58,19.56 | 6.58,19.56 R8.1 | 6.58,19.56 6.58,20.57 11.9,25.9 36.72,25.9 37.58,25.04 37.58,23.2 J1.4
SWDIO
  Top 0.254: U1.23 7.52,16.66 7.52,17.09 7.5,17.11 7.5,20.57 12.47,25.54 36.57,25.54 37.22,24.89 37.22,24.5 36.34,23.63 J1.2
TRIG
  Top 0.254: U1.5 13.38,13.04 13.68,13.34 16.32,13.34 R23.1
VCAP  (via drill 0.35)
  Top 0.254: 37.11,16.4 C16.CATHODE | 37.01,2.7 37.11,2.8 37.11,6.6 36.85,6.35 v35.54,6.35 | C16.CATHODE 37.11,12.49 C17.CATHODE C18.CATHODE 37.01,9.29 C19.CATHODE 37.01,2.7 | 37.01,2.7 C20.CATHODE | v31.17,15.96 29.91,15.96 U5.3 27.92,16.21 27.92,19.05 27.29,19.68 | Q3.4 25.18,19.67 25.25,19.67 25.4,19.81 27.16,19.81 27.29,19.68 | C15.1 24.33,3.94 U7.6 25.16,4.17 25.71,3.62 30.42,3.62 30.88,4.07 30.88,6.74 30.91,6.78 | v32.68,6.35 31.69,6.35 30.91,6.78 | 30.91,6.78 R14.1 | v35.29,15.96 37.11,17.78 | C16.CATHODE 37.11,17.78 | R19.1 27.29,18.14 27.29,19.68 | 37.11,17.78 38.92,19.59 | 38.92,19.59 39.91,20.58 J2.1 40.29,23.88 L3.1 | JP1.1 40.35,16.25 39.07,17.54 39.07,19.44 38.92,19.59
  Bottom 0.254: v31.17,15.96 v35.29,15.96 | 35.8,6.35 v35.54,6.35 v32.68,6.35
VDD_PA
  Top 0.254: U1.30 3.67,13.84 3.55,13.98 | 3.55,13.98 3.44,14.11 3.23,14.11 B1.VCC | 3.55,13.98 3.16,14.37 C6.1
VREG  (via drill 0.35)
  Top 0.254: R1.1 11.92,5.61 12.18,5.61 | 12.18,5.61 13.13,5.61 U4.3 | 12.18,5.61 12.18,6.12 R4.2 13.14,7.62 13.14,8.51 v13.17,8.54 | C11.1 17.27,3.1 U4.8 17.07,3.33 U4.7 17,2.27 v17,2.03 | U7.5 26.15,4.8 26.15,5.65 R16.1 25.07,6.7 | v13.6,10.67 13.95,11.03 13.95,11.18 | U2.2 16.89,7.32 C10.1 | 13.26,16.76 U1.12 | 13.28,11.18 13.02,11.44 U1.1
  Top 0.406: C9.1 C14.1 16.97,11.18 15.22,11.18 | v11.84,4.76 11.84,5.53 11.92,5.61 | v14.46,16.76 13.26,16.76 | 15.22,11.18 13.95,11.18 13.28,11.18 | U4.8 17.27,4.33 v17.89,4.95 | 23.33,5.83 v23.27,5.77 23.33,5.83 C13.1 23.84,6.7 25.07,6.7 | C10.1 17.03,7.32 17.66,7.94 18.26,7.94 v19.44,6.76 | v15.22,12.07 15.22,11.18 | v34.02,22.37 34.88,23.23 J1.1
  Bottom 0.254: v13.17,8.54 13.17,10.25 v13.6,10.67
  Bottom 0.406: v17,2.03 14.21,2.03 11.84,4.4 v11.84,4.76 | v14.46,16.76 15.69,16.76 | 15.69,16.76 25.3,16.76 25.47,16.59 33.28,16.59 | 33.28,16.59 37.98,16.59 38.47,16.09 38.47,14.51 40.35,12.63 JP1.2 | v17.89,4.95 18.71,5.77 19.79,5.77 | 19.79,5.77 v23.27,5.77 | v19.44,6.76 19.79,6.41 19.79,5.77 | v15.22,12.07 15.22,13.1 14.34,13.99 14.34,15.41 15.69,16.76 | v34.02,22.37 33.28,21.63 33.28,16.59
(copper drawn outside any net)
  shapes: Top area x2

### Text on the board
tPlace: Herald | Nurani / Saoda | REV C | 07/12/18 | C:/Users/ns8nf/Documents/eagle/sensor/logo1.bmp | +
tNames: - | VCAP | VREG | MOSI | MISO | GND
bNames: SW1 | SW4 | SW2 | SW3
206bmp: -